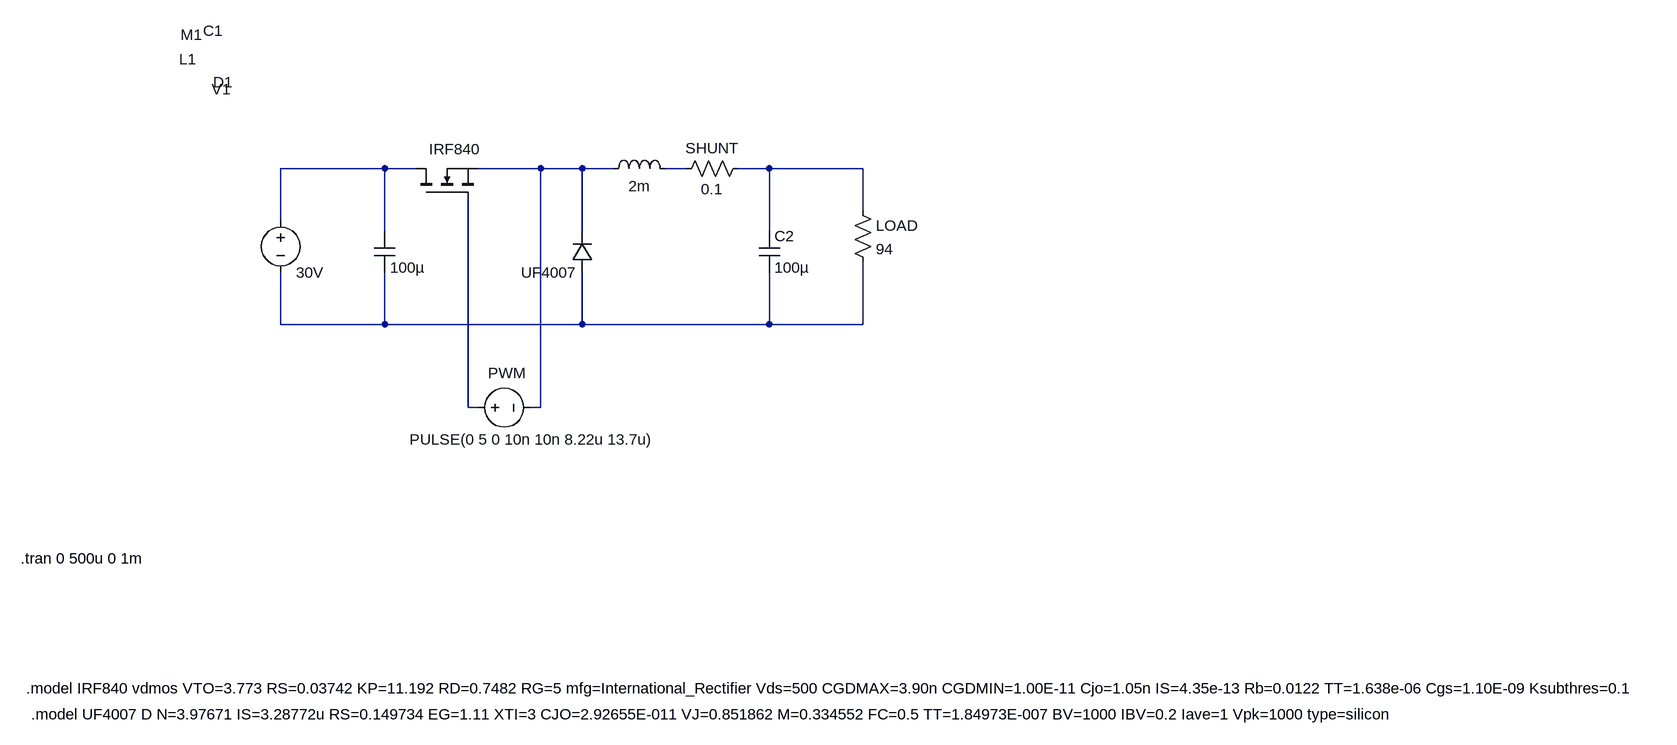
[diagram p0: schematic Energy Harvest.asc]
Energy Harvest.asc, the LTspice schematic file:
Version 4.1
SHEET 1 3120 712
WIRE 288 -144 128 -144
WIRE 336 -144 288 -144
WIRE 528 -144 432 -144
WIRE 592 -144 528 -144
WIRE 640 -144 592 -144
WIRE 752 -144 720 -144
WIRE 880 -144 832 -144
WIRE 1024 -144 880 -144
WIRE 1024 -80 1024 -144
WIRE 128 -64 128 -144
WIRE 288 -48 288 -144
WIRE 592 -48 592 -144
WIRE 880 -48 880 -144
WIRE 128 96 128 16
WIRE 288 96 288 16
WIRE 288 96 128 96
WIRE 592 96 592 16
WIRE 592 96 288 96
WIRE 880 96 880 16
WIRE 880 96 592 96
WIRE 1024 96 1024 0
WIRE 1024 96 880 96
WIRE 416 224 416 -96
WIRE 432 224 416 224
WIRE 528 224 528 -144
WIRE 528 224 512 224
SYMBOL voltage 416 224 R270
WINDOW 123 0 0 Left 0
WINDOW 39 0 0 Left 0
WINDOW 0 53 31 VRight 2
WINDOW 3 -49 -90 VRight 2
SYMATTR InstName PWM
SYMATTR Value PULSE(0 5 0 10n 10n 8.22u 13.7u)
SYMBOL voltage 128 -80 R0
WINDOW 0 -106 -186 Left 2
WINDOW 123 0 0 Left 0
WINDOW 39 0 0 Left 0
SYMATTR InstName V1
SYMATTR Value 30V
SYMBOL cap 272 -48 R0
WINDOW 0 -263 -308 Left 2
SYMATTR InstName C1
SYMATTR Value 100µ
SYMBOL nmos 336 -96 R270
WINDOW 0 254 -362 VRight 2
WINDOW 3 78 20 VRight 2
SYMATTR InstName M1
SYMATTR Value IRF840
SYMBOL diode 608 16 R180
WINDOW 0 553 293 Left 2
WINDOW 3 24 0 Left 2
SYMATTR InstName D1
SYMATTR Value UF4007
SYMBOL ind 624 -128 R270
WINDOW 0 169 -639 VTop 2
WINDOW 3 5 56 VBottom 2
SYMATTR InstName L1
SYMATTR Value 2m
SYMBOL res 848 -160 R90
WINDOW 0 0 56 VBottom 2
WINDOW 3 32 56 VTop 2
SYMATTR InstName SHUNT
SYMATTR Value 0.1
SYMBOL cap 864 -48 R0
SYMATTR InstName C2
SYMATTR Value 100µ
SYMBOL res 1008 -96 R0
SYMATTR InstName LOAD
SYMATTR Value 94
TEXT -272 456 Left 2 !.tran 0 500u 0 1m
TEXT -264 656 Left 2 !.model IRF840 vdmos VTO=3.773 RS=0.03742 KP=11.192 RD=0.7482 RG=5 mfg=International_Rectifier Vds=500 CGDMAX=3.90n CGDMIN=1.00E-11 Cjo=1.05n IS=4.35e-13 Rb=0.0122 TT=1.638e-06 Cgs=1.10E-09 Ksubthres=0.1
TEXT -256 696 Left 2 !.model UF4007 D N=3.97671 IS=3.28772u RS=0.149734 EG=1.11 XTI=3 CJO=2.92655E-011 VJ=0.851862 M=0.334552 FC=0.5 TT=1.84973E-007 BV=1000 IBV=0.2 Iave=1 Vpk=1000 type=silicon

The netlist it stands for:
* Energy Harvest.asc
V§PWM N006 N002 PULSE(0 5 0 10n 10n 8.22u 13.7u)
V1 N001 N005 30V
C1 N001 N005 100µ
M1 N001 N006 N002 N002 IRF840
D1 N005 N002 UF4007
L1 N002 N003 2m
R§SHUNT N004 N003 0.1
C2 N004 N005 100µ
R§LOAD N004 N005 94
.model D D
.lib standard.dio
.model NMOS NMOS
.model PMOS PMOS
.lib standard.mos
.tran 0 500u 0 1m
.model IRF840 vdmos VTO=3.773 RS=0.03742 KP=11.192 RD=0.7482 RG=5 mfg=International_Rectifier Vds=500 CGDMAX=3.90n CGDMIN=1.00E-11 Cjo=1.05n IS=4.35e-13 Rb=0.0122 TT=1.638e-06 Cgs=1.10E-09 Ksubthres=0.1
.model UF4007 D N=3.97671 IS=3.28772u RS=0.149734 EG=1.11 XTI=3 CJO=2.92655E-011 VJ=0.851862 M=0.334552 FC=0.5 TT=1.84973E-007 BV=1000 IBV=0.2 Iave=1 Vpk=1000 type=silicon
.backanno
.end